# EasyEDA Pro project ProPrj_USB Connector_2025-09-04.epro

# Schematic Schematic1
Board Name: Board1; Create Date: 2025-08-17; Page Name: P1; Project Name: USB Connector; Schematic Name: Schematic1; Update Date: 2025-08-22; Company: EasyEDA.com; Page Size: A4; Version: V1.0
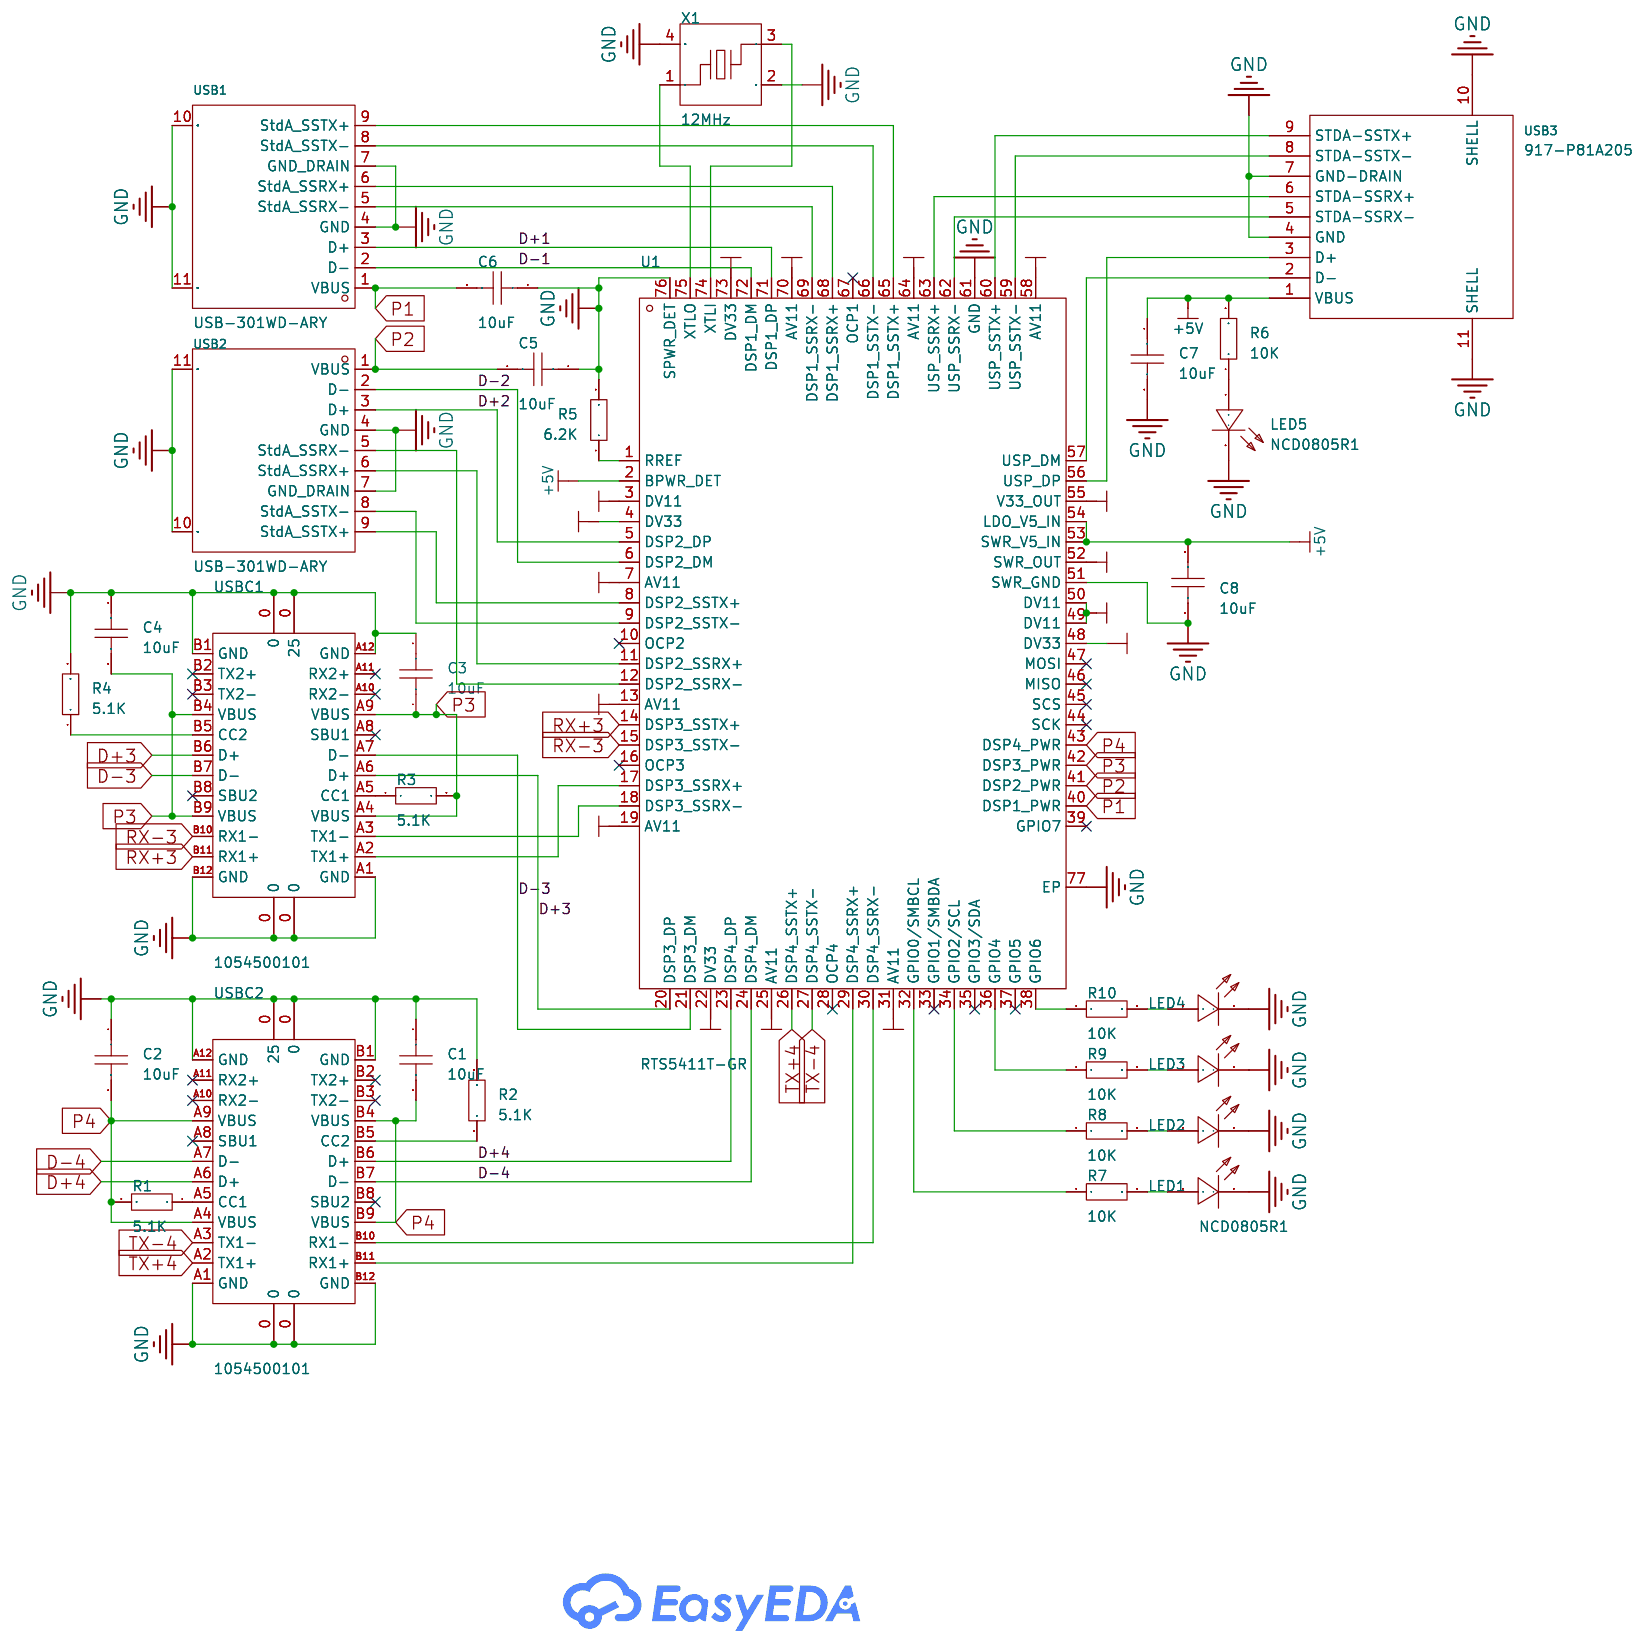
[diagram p0: schematic sheet]

## Parts
C1  10uF  [C0603]
C2  10uF  [C0603]
C3  10uF  [C0603]
C4  10uF  [C0603]
C5  10uF  [C0603]
C6  10uF  [C0603]
C7  10uF  [C0603]
C8  10uF  [C0603]
LED1  NCD0805R1  [LED0805-R-RD]
LED2  NCD0805R1  [LED0805-R-RD]
LED3  NCD0805R1  [LED0805-R-RD]
LED4  NCD0805R1  [LED0805-R-RD]
LED5  NCD0805R1  [LED0805-R-RD]
R1  5.1K  [R0603]
R2  5.1K  [R0603]
R3  5.1K  [R0603]
R4  5.1K  [R0603]
R5  6.2K  [R0603]
R6  10K  [R0603]
R7  10K  [R0603]
R8  10K  [R0603]
R9  10K  [R0603]
R10  10K  [R0603]
U1  RTS5411T-GR  [QFN-76_L9.0-W9.0-P0.40-BL-EP5.4]
USB1  USB-301WD-ARY  [USB-TH_XUNPU_USB-301WD-ARY]
USB2  USB-301WD-ARY  [USB-TH_XUNPU_USB-301WD-ARY]
USB3  917-P81A205CS60202  [USB-3.0-SMD_CU3M002_USBA-M]
USBC1  1054500101  [USB-C-SMD_TYPE-C-USB-18]
USBC2  1054500101  [USB-C-SMD_TYPE-C-USB-18]
X1  12MHz  [CRYSTAL-SMD_4P-L3.2-W2.5-BL-1]

## Library data of the parts
C1-C8 = CAP_0603: Supplier Footprint: 0603
LED1-LED5 = NCD0805R1_C84256: Lamp Holder Type:- Emitted Color:Red Forward Voltage (VF):1.6V~2.6V Forward Voltage (VF):1.6V~2.6V Power Dissipation:65mW Forward Current:20mA Dominant Wavelength:615nm~630nm Dominant Wavelength:615nm~630nm Peak Wavelength:- Diode Configuration:独立二极管 Lens; Supplier Part: C84256; Manufacturer: 国星光电; Supplier Footprint: 0805; JLCPCB Part Class: Basic Part; Datasheet: https://atta.szlcsc.com/upload/public/pdf/source/20200820/C84256_F0A75A43B3EAD75808600A0514C76B99.pdf; Supplier: LCSC; Emitted Color: Red; Forward Voltage (VF): 1.6V~2.6V; Power Dissipation: 65mW; Forward Current: 20mA; Dominant Wavelength: 615nm~630nm; Diode Configuration: 独立二极管; Lens Color: 无色透明透镜; Luminous Intensity: 67mcd~195mcd; Viewing Angle: 130°; Operating Temperature: -30℃~+85℃
R1-R10 = Res_0603: Supplier Footprint: 0603
U1 = RTS5411T-GR: type:Hub USB Protocol:USB 3.2 Voltage - Supply:3.3V；1.1V Voltage - Supply:3.3V；1.1V Operating Temperature:0℃~+70℃ Operating Temperature:0℃~+70℃; LCSC Part Name: RTS5411T USB3.2 Gen1x1 超高速 USB 集线器控制器; Supplier Part: C5159024; Manufacturer: REALTEK(瑞昱); Supplier Footprint: QFN-76(9x9); JLCPCB Part Class: Extended Part; Datasheet: https://atta.szlcsc.com/upload/public/pdf/source/20240319/5D12B3C0D31F8AE4B5F4A601072DAD0E.pdf; Supplier: LCSC; type: Hub; USB Protocol: USB 3.2; Voltage - Supply: 3.3V；1.1V; Operating Temperature: 0℃~+70℃
USB1 USB2 = USB-301WD-ARY: Connector Type:Type-A Standard:USB 3.0 Gender:Female Number of Ports:1 Number of Contacts:9P Mounting Style:Right-Angle Current Rating - Power (Max):1.8A Contact Material:- Contact Plating:- Operating Temperature Range:-55℃~+85℃ Operating Temperature Rang; LCSC Part Name: Type-A 母 弯插; Supplier Part: C2895025; Manufacturer: XUNPU(讯普); Supplier Footprint: 插件; JLCPCB Part Class: Extended Part; Datasheet: https://atta.szlcsc.com/upload/public/pdf/source/20210908/6BA804621BB79CD49F2A1A281A5A9824.pdf; Supplier: LCSC; Connector Type: Type-A; Standard: USB 3.0; Gender: Female; Number of Ports: 1; Number of Contacts: 9P; Mounting Style: Right-Angle; Current Rating - Power (Max): 1.8A; Operating Temperature Range: -55℃~+85℃; Soldering Temperature(Max): 260℃
USB3 = 917-P81A205CS60202: Connector Type:Type-A Protocol Standard:USB 3.0 Gender:Male Number of Contacts:9P Number of Ports:1 Current Rating-Power:250mA; LCSC Part Name: Type-A 公; Supplier Part: C68740; Manufacturer: 精拓金; Supplier Footprint: SMD; JLCPCB Part Class: Extended Part; Datasheet: https://item.szlcsc.com/datasheet/917-P81A205CS60202/69850.html; Supplier: LCSC; Connector Type: Type-A; Protocol Standard: USB 3.0; Gender: Male; Number of Contacts: 9P; Number of Ports: 1; Current Rating-Power: 250mA
USBC1 USBC2 = 1054500101: Connector Type:Type-C Protocol Standard:USB 3.2 Gender:Female Number of Contacts:24P Number of Ports:1 Current Rating-Power:- Operating Temperature:-30℃~+85℃ Operating Temperature:-30℃~+85℃; LCSC Part Name: Type-C 母; Supplier Part: C134092; Manufacturer: MOLEX; Supplier Footprint: SMD; JLCPCB Part Class: Extended Part; Datasheet: https://www.molex.com/content/dam/molex/molex-dot-com/products/automated/en-us/salesdrawingpdf/105/105450/1054500101_sd.pdf?inline\; Supplier: LCSC; Connector Type: Type-C; Protocol Standard: USB 3.2; Gender: Female; Number of Contacts: 24P; Number of Ports: 1; Operating Temperature: -30℃~+85℃
X1 = XL2EL89COI-111YLC-12M: Type:Crystal Oscillator Frequency:12MHz Normal temperature Frequency Tolerance:±10ppm Normal temperature Frequency Tolerance:±10ppm Load Capacitance:12pF Frequency Stability:±20ppm Frequency Stability:±20ppm Operating Temperature:-40℃~+85℃ Operating Tempe; LCSC Part Name: YSX321SL 12MHZ 4P 3225 12PF ±10PPM -40~85℃ (±20PPM); Supplier Part: C5280578; Manufacturer: YXC(扬兴晶振); Supplier Footprint: SMD3225-4P; JLCPCB Part Class: Extended Part; Datasheet: https://item.szlcsc.com/datasheet/XL2EL89COI-111YLC-12M/6016760.html; Supplier: LCSC; Type: Crystal Oscillator; Normal temperature Frequency Tolerance: ±10ppm; Load Capacitance: 12pF; Frequency Stability: ±20ppm; Operating Temperature: -40℃~+85℃

## Nets
+1V1: U1.3(DV11) U1.7(AV11) U1.13(AV11) U1.19(AV11) U1.25(AV11) U1.31(AV11) U1.49(DV11) U1.50(DV11) U1.52(SWR_OUT) U1.58(AV11) U1.64(AV11) U1.70(AV11)
+3V3: U1.4(DV33) U1.22(DV33) U1.48(DV33) U1.55(V33_OUT) U1.73(DV33)
+5V: C7.1 C8.2 R6.2 U1.2(BPWR_DET) U1.53(SWR_V5_IN) U1.54(LDO_V5_IN) USB3.1(VBUS)
GND: C1.1 C2.1 C3.2 C4.1 C5.1 C6.1 C7.2 C8.1 LED1.2(-) LED2.2(-) LED3.2(-) LED4.2(-) LED5.2(-) R2.2 R4.2 R5.2 U1.51(SWR_GND) U1.61(GND) U1.76(SPWR_DET) U1.77(EP) USB1.4(GND) USB1.7(GND_DRAIN) USB1.10(SHIELD) USB1.11(SHIELD) USB2.4(GND) USB2.7(GND_DRAIN) USB2.10(SHIELD) USB2.11(SHIELD) USB3.4(GND) USB3.7(GND-DRAIN) USB3.10(SHELL) USB3.11(SHELL) USBC1.0 USBC1.A1(GND) USBC1.A12(GND) USBC1.B1(GND) USBC1.B12(GND) USBC2.0 USBC2.A1(GND) USBC2.A12(GND) USBC2.B1(GND) USBC2.B12(GND) X1.2(GND) X1.4(GND)
D+1: U1.71(DSP1_DP) USB1.3(D+)
D+2: U1.5(DSP2_DP) USB2.3(D+)
D+3: U1.20(DSP3_DP) USBC1.A6(D+) USBC1.B6(D+)
D+4: U1.23(DSP4_DP) USBC2.A6(D+) USBC2.B6(D+)
D-1: U1.72(DSP1_DM) USB1.2(D-)
D-2: U1.6(DSP2_DM) USB2.2(D-)
D-3: U1.21(DSP3_DM) USBC1.A7(D-) USBC1.B7(D-)
D-4: U1.24(DSP4_DM) USBC2.A7(D-) USBC2.B7(D-)
P1: C6.2 U1.40(DSP1_PWR) USB1.1(VBUS)
P2: C5.2 U1.41(DSP2_PWR) USB2.1(VBUS)
P3: C3.1 C4.2 R3.2 U1.42(DSP3_PWR) USBC1.A4(VBUS) USBC1.A9(VBUS) USBC1.B4(VBUS) USBC1.B9(VBUS)
P4: C1.2 C2.2 R1.2 U1.43(DSP4_PWR) USBC2.A4(VBUS) USBC2.A9(VBUS) USBC2.B4(VBUS) USBC2.B9(VBUS)
RX+3: U1.14(DSP3_SSTX+) USBC1.B11(RX1+)
RX-3: U1.15(DSP3_SSTX-) USBC1.B10(RX1-)
TX+4: U1.26(DSP4_SSTX+) USBC2.A2(TX1+)
TX-4: U1.27(DSP4_SSTX-) USBC2.A3(TX1-)
$1N3590: U1.12(DSP2_SSRX-) USB2.5(StdA_SSRX-)
$1N3596: U1.11(DSP2_SSRX+) USB2.6(StdA_SSRX+)
$1N3603: U1.8(DSP2_SSTX+) USB2.9(StdA_SSTX+)
$1N3610: U1.9(DSP2_SSTX-) USB2.8(StdA_SSTX-)
$1N3617: U1.65(DSP1_SSTX+) USB1.9(StdA_SSTX+)
$1N3622: U1.66(DSP1_SSTX-) USB1.8(StdA_SSTX-)
$1N3628: U1.69(DSP1_SSRX-) USB1.5(StdA_SSRX-)
$1N3637: U1.68(DSP1_SSRX+) USB1.6(StdA_SSRX+)
$1N3848: U1.29(DSP4_SSRX+) USBC2.B11(RX1+)
$1N3853: U1.30(DSP4_SSRX-) USBC2.B10(RX1-)
$1N3939: R1.1 USBC2.A5(CC1)
$1N3974: R2.1 USBC2.B5(CC2)
$1N3996: U1.18(DSP3_SSRX-) USBC1.A3(TX1-)
$1N4002: U1.17(DSP3_SSRX+) USBC1.A2(TX1+)
$1N4082: R3.1 USBC1.A5(CC1)
$1N4114: R4.1 USBC1.B5(CC2)
$1N4604: U1.59(USP_SSTX-) USB3.8(STDA-SSTX-)
$1N4609: U1.60(USP_SSTX+) USB3.9(STDA-SSTX+)
$1N4615: U1.62(USP_SSRX-) USB3.5(STDA-SSRX-)
$1N4620: U1.63(USP_SSRX+) USB3.6(STDA-SSRX+)
$1N4626: U1.57(USP_DM) USB3.2(D-)
$1N4632: U1.56(USP_DP) USB3.3(D+)
$1N5187: R5.1 U1.1(RREF)
$1N5405: U1.75(XTLO) X1.1
$1N5413: U1.74(XTLI) X1.3
$1N5825: R10.1 U1.38(GPIO6)
$1N5829: R9.1 U1.36(GPIO4)
$1N5835: R8.1 U1.34(GPIO2/SCL)
$1N5841: R7.1 U1.32(GPIO0/SMBCL)
$1N5974: LED5.1(+) R6.1
$1N6057: LED1.1(+) R7.2
$1N6084: LED2.1(+) R8.2
$1N6111: LED3.1(+) R9.2
$1N6138: LED4.1(+) R10.2

Not connected (* = marked no-connect by the designer): U1 10(OCP2)* 16(OCP3)* 28(OCP4)* 33(GPIO1/SMBDA)* 35(GPIO3/SDA)* 37(GPIO5)* 39(GPIO7)* 44(SCK)* 45(SCS)* 46(MISO)* 47(MOSI)* 67(OCP1)*; USBC1 A8(SBU1)* A10(RX2-)* A11(RX2+)* B2(TX2+)* B3(TX2-)* B8(SBU2)*; USBC2 A8(SBU1)* A10(RX2-)* A11(RX2+)* B2(TX2+)* B3(TX2-)* B8(SBU2)*

# Board PCB1
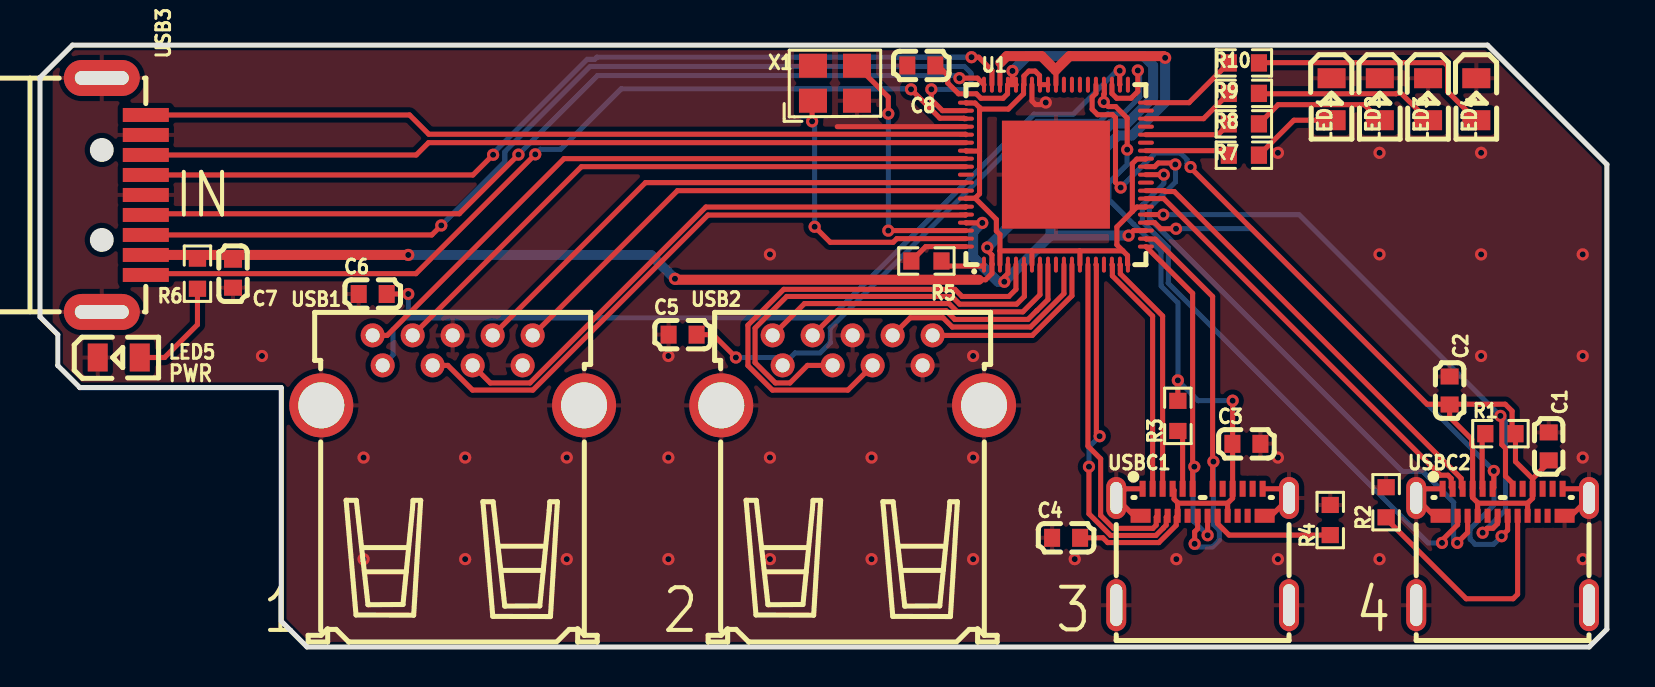
[diagram p1: board, top side]
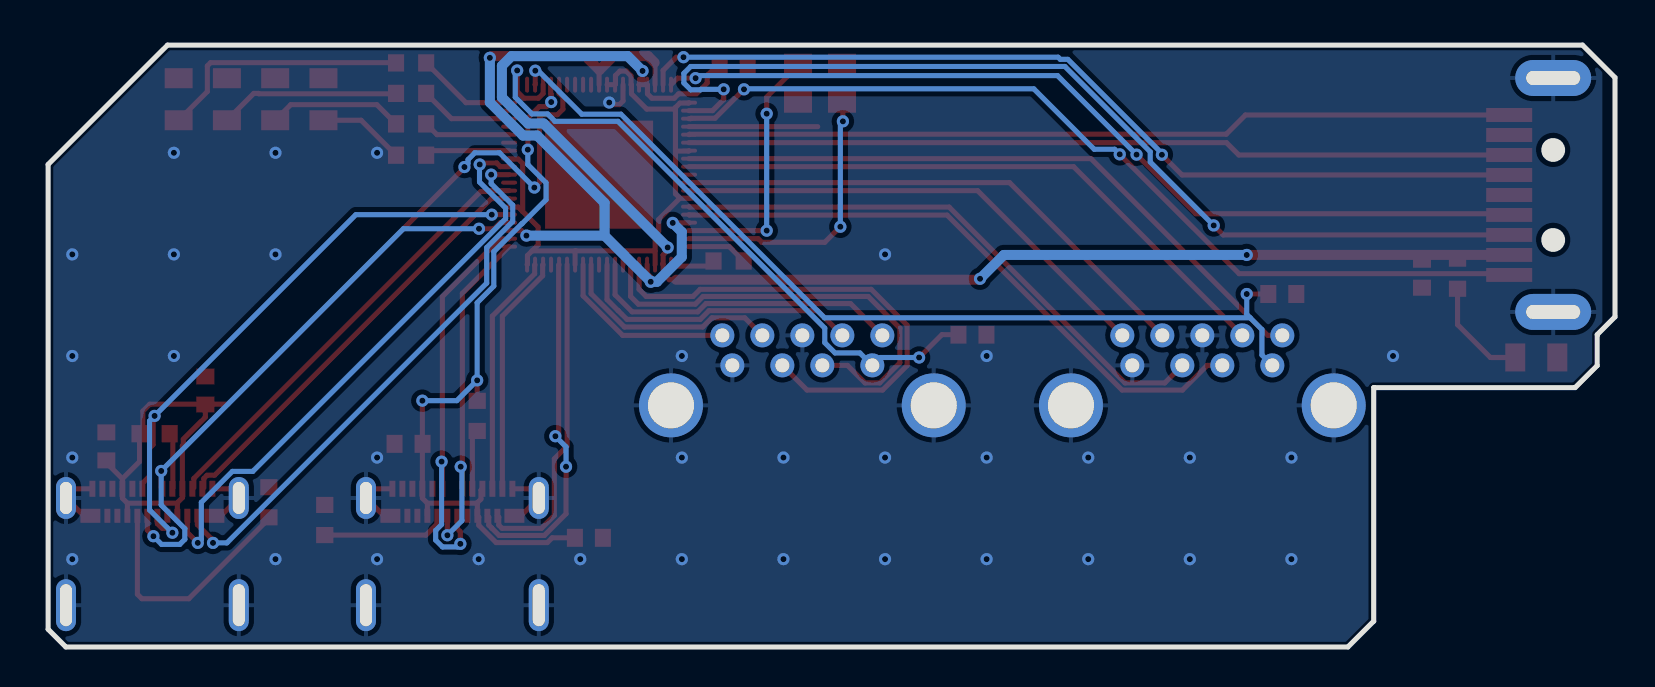
[diagram p2: board, bottom side, seen from below]

Outline 78.35 x 30.1 mm; copper layers: Top Layer, Bottom Layer. Coordinates in mm from the lower left corner of the outline.
Outline path: 0,28.48 1.62,30.1 72.38,30.1 78.35,24.13 78.35,0.89 77.46,0 13.36,0 12.07,1.29 12.07,12.97 1.99,12.97 0.89,14.08 0.89,15.62 0,16.51 0,28.48
Stack: Top Layer 0.035mm / Dielectric1 1.51mm FR4 er 4.5 / Bottom Layer 0.035mm

## Design rules (mm)
template: JLCPCB Capability(Two Layers Board)
spacing copperThickness1oz (default): track to track 0.102, other pairs 0.152 to 0.3
spacing copperThickness2oz: track to track 0.203, other pairs 0.152 to 0.3
track width copperThickness1oz (default): min 0.127, default 0.254, max 2.54
track width copperThickness2oz: min 0.203, default 0.254, max 2.54
differential pair differentialPair (default): width min 0.127, default 0.254, max 2.54; gap min 0.152, default 0.152
via viaSize (default): diameter min 0.5, default 0.61, max 10; hole min 0.3, default 0.305, max 6.3

## Placement (name value [footprint] x y rotation side)
C1  10uF  [C0603]  75.44 10.03 270 top
C2  10uF  [C0603]  70.48 12.83 270 top
C3  10uF  [C0603]  60.33 10.16 0 top
C4  10uF  [C0603]  51.31 5.46 0 top
C5  10uF  [C0603]  32.13 15.62 0 top
C6  10uF  [C0603]  16.64 17.65 0 top
C7  10uF  [C0603]  9.65 18.67 270 top
C8  10uF  [C0603]  44.07 29.08 0 top
LED1  NCD0805R1  [LED0805-R-RD]  64.58 27.39 270 top
LED2  NCD0805R1  [LED0805-R-RD]  67 27.39 270 top
LED3  NCD0805R1  [LED0805-R-RD]  69.41 27.39 270 top
LED4  NCD0805R1  [LED0805-R-RD]  71.82 27.39 270 top
LED5  NCD0805R1  [LED0805-R-RD]  3.94 14.48 0 top
R1  5.1K  [R0603]  73.02 10.67 0 top
R2  5.1K  [R0603]  67.31 7.24 90 top
R3  5.1K  [R0603]  56.9 11.56 90 top
R4  5.1K  [R0603]  64.52 6.35 90 top
R5  6.2K  [R0603]  44.32 19.3 180 top
R6  10K  [R0603]  7.87 18.67 90 top
R7  10K  [R0603]  60.2 24.6 0 top
R8  10K  [R0603]  60.2 26.16 0 top
R9  10K  [R0603]  60.2 27.69 0 top
R10  10K  [R0603]  60.2 29.21 0 top
U1  RTS5411T-GR  [QFN-76_L9.0-W9.0-P0.40-BL-EP5.4]  50.8 23.62 0 top
USB1  USB-301WD-ARY  [USB-TH_XUNPU_USB-301WD-ARY]  20.64 13.83 0 top
USB2  USB-301WD-ARY  [USB-TH_XUNPU_USB-301WD-ARY]  40.64 13.83 0 top
USB3  917-P81A205CS60202  [USB-3.0-SMD_CU3M002_USBA-M]  4.19 22.61 270 top
USBC1  1054500101  [USB-C-SMD_TYPE-C-USB-18]  58.14 5 0 top
USBC2  1054500101  [USB-C-SMD_TYPE-C-USB-18]  73.14 5 0 top
X1  12MHz  [CRYSTAL-SMD_4P-L3.2-W2.5-BL-1]  39.75 28.19 0 top

## Footprints (pads in the part's own frame, mm; a bottom-side part is the same pattern mirrored in y, then rotated)
C0603
  rect 0.8x0.9 smd: 1(-0.7,0) 2(0.7,0)
CRYSTAL-SMD_4P-L3.2-W2.5-BL-1
  rect 1.4x1.2 smd: 1(-1.1,-0.875) 2(1.1,-0.875) 3(1.1,0.875) 4(-1.1,0.875)
LED0805-R-RD
  rect 1x1.399 smd: 1(1.05,0) 2(-1.05,0)
QFN-76_L9.0-W9.0-P0.40-BL-EP5.4
  oval 0.2x0.8 smd: 1(-3.599,-4.5) 2(-3.2,-4.5) 3(-2.799,-4.5) 4(-2.401,-4.5) 5(-1.999,-4.5) 6(-1.6,-4.5) 7(-1.199,-4.5) 8(-0.8,-4.5) 9(-0.399,-4.5) 10(0,-4.5) 11(0.399,-4.5) 12(0.8,-4.5) 13(1.199,-4.5) 14(1.6,-4.5) 15(1.999,-4.5) 16(2.401,-4.5) 17(2.799,-4.5) 18(3.2,-4.5) 19(3.599,-4.5) 39(3.599,4.5) 40(3.2,4.5) 41(2.799,4.5) 42(2.401,4.5) 43(1.999,4.5) 44(1.6,4.5) 45(1.199,4.5) 46(0.8,4.5) 47(0.399,4.5) 48(0,4.5) 49(-0.399,4.5) 50(-0.8,4.5) 51(-1.199,4.5) 52(-1.6,4.5) 53(-1.999,4.5) 54(-2.401,4.5) 55(-2.799,4.5) 56(-3.2,4.5) 57(-3.599,4.5)
  oval 0.8x0.2 smd: 20(4.5,-3.599) 21(4.5,-3.2) 22(4.5,-2.799) 23(4.5,-2.401) 24(4.5,-1.999) 25(4.5,-1.6) 26(4.5,-1.199) 27(4.5,-0.8) 28(4.5,-0.399) 29(4.5,0) 30(4.5,0.399) 31(4.5,0.8) 32(4.5,1.199) 33(4.5,1.6) 34(4.5,1.999) 35(4.5,2.401) 36(4.5,2.799) 37(4.5,3.2) 38(4.5,3.599) 58(-4.5,3.599) 59(-4.5,3.2) 60(-4.5,2.799) 61(-4.5,2.401) 62(-4.5,1.999) 63(-4.5,1.6) 64(-4.5,1.199) 65(-4.5,0.8) 66(-4.5,0.399) 67(-4.5,0) 68(-4.5,-0.399) 69(-4.5,-0.8) 70(-4.5,-1.199) 71(-4.5,-1.6) 72(-4.5,-1.999) 73(-4.5,-2.401) 74(-4.5,-2.799) 75(-4.5,-3.2) 76(-4.5,-3.599)
  rect 5.4x5.4 smd: 77(0,0)
R0603
  rect 0.806x0.864 smd: 1(-0.753,0) 2(0.753,0)
USB-3.0-SMD_CU3M002_USBA-M
  rect 0.7x2.3 smd: 1(3,1.1) 2(1,1.1) 3(-1,1.1) 4(-3,1.1) 5(-4,1.1) 6(-2,1.1) 7(0,1.1) 8(2,1.1) 9(4,1.1)
  oval 1.8x3.8 hole 0.7x2.7: 10(5.85,-1.1) 11(-5.85,-1.1)
USB-C-SMD_TYPE-C-USB-18
  oval 1x2.1 hole 0.6x1.6: 0(-4.32,2.45) 0(4.32,2.45)
  oval 1x2.6 hole 0.6x2.1: 0(-4.32,-2.91) 0(4.32,-2.91)
  rect 0.3x0.8 smd: A1(-3,2.91) A2(-2.5,2.91) A3(-2,2.91) A4(-1.5,2.91) A5(-1,2.91) A6(-0.5,2.91) A7(0.5,2.91) A8(1,2.91) A9(1.5,2.91) A10(2,2.91) A11(2.5,2.91) A12(3,2.91)
  rect 1x0.7 smd: B1(3.1,1.56) B12(-3.1,1.56)
  rect 0.3x0.7 smd: B2(2.25,1.56) B3(1.75,1.56) B4(1.25,1.56) B5(0.75,1.56) B6(0.25,1.56) B7(-0.25,1.56) B8(-0.75,1.56) B9(-1.25,1.56) B10(-1.75,1.56) B11(-2.25,1.56)
USB-TH_XUNPU_USB-301WD-ARY
  round 1.2 hole 0.7: 1(-3.5,0.25) 2(-1,0.25) 3(1,0.25) 4(3.5,0.25) 5(4,1.75) 6(2,1.75) 7(0,1.75) 8(-2,1.75) 9(-4,1.75)
  round 3.2 hole 2.3: 10(-6.57,-1.75) 11(6.57,-1.75)

## Nets
As in the schematic.

Pads without a net: U1 10 16 28 33 35 37 39 44 45 46 47 67; USBC1 A8 A10 A11 B2 B3 B8; USBC2 A8 A10 A11 B2 B3 B8

## Via types
v1: diameter 0.61, hole 0.305, Top Layer to Bottom Layer, 80 vias

## Routing (per net, layer and track width the routed paths; a pad name or vN(x,y) marks a point on that pad's centre or on a via; arc(x,y) is an arc through that point)
+1V1: length 30.4
  Top Layer w0.254: 51.98,19.81 52,19.79 U1.13 ; 51.98,19.81 54.15,19.81 ; 51.98,19.81 49.58,19.81 ; 46.76,22.44 46.32,22.44 U1.70 ; 46.76,22.44 46.98,22.66 46.98,24.8 ; 46.76,22.44 47.82,21.38 47.82,20.81 48,20.63 48,19.81 ; 48,19.81 49.58,19.81 ; 48,19.81 U1.3 ; 49.58,19.81 49.6,19.79 U1.7 ; 46.98,26.98 46.76,27.2 46.32,27.2 U1.58 ; 46.98,26.98 47.06,26.9 48.42,26.9 49.18,27.66 49.18,28.1 U1.52 49.2,28.56 49.44,28.8 49.76,28.8 49.98,28.58 49.98,28.14 U1.50 U1.49 ; 46.98,26.98 46.98,24.8 ; U1.25 55.28,22 54.84,22 54.62,21.78 ; 46.98,24.8 46.32,24.8 U1.64 ; U1.31 55.28,24.4 54.84,24.4 54.62,24.18 54.62,21.79 54.62,21.78 ; 54.62,21.78 53.85,21.01 53.85,20.11 54.15,19.81 ; 54.15,19.81 54.38,19.58 54.38,19.14 U1.19
+3V3: length 36.3
  Top Layer w0.254: U1.73 46.31,21.21 v1(47.12,21.21) ; v1(54.43,20.57) 54.68,20.82 U1.22 ; v1(48.22,18.27) 48.22,18.5 48.4,18.68 U1.4 ; U1.55 48,29.2 ; U1.48 50.8,28.83
  Top Layer w0.5: 48.02,29.22 48.35,29.55 50.08,29.55 50.78,28.85 51.48,29.55 56.18,29.55 v1(56.26,29.46)
  Bottom Layer w0.5: v1(54.43,20.57) 50.53,20.57 ; 50.53,20.57 v1(48.22,18.27) 47.9,18.27 46.66,19.5 46.66,20.76 v1(47.12,21.21) ; 50.53,20.57 50.53,22.21 53.9,25.58 54.6,25.58 56.26,27.24 v1(56.26,29.46)
+5V: length 71.1
  Top Layer w0.254: C8.2 44.9,29.08 45.39,28.59 45.39,28.21 45.93,27.66 46.82,27.66 47.04,27.44 48.16,27.44 48.38,27.66 48.38,28.1 U1.54 U1.53 48.63,28.3 v1(48.63,28.81) ; U1.2 47.6,18.69 47.28,18.37 46.95,18.37 ; v1(47.37,19.98) 47.37,19.83 47.6,19.6 47.6,19.17 47.62,19.14
  Top Layer w0.5: v1(31.75,18.41) 31.8,18.37 46.95,18.37 ; USB3.1 v1(18.42,19.61)
  Bottom Layer w0.5: v1(47.37,19.98) 53.57,26.18 54.35,26.18 55.66,27.49 55.66,29.07 55.18,29.55 49.37,29.55 v1(48.63,28.81) ; v1(18.42,19.61) 30.56,19.61 v1(31.75,18.41)
GND: length 23.4
  Top Layer w0.254: USBC2.B12 69.7,6.56 USBC2.0 69.27,7.91 USBC2.A1 ; USBC2.A12 77,7.91 USBC2.0 76.57,6.56 USBC2.B1 ; USBC1.A12 62,7.91 USBC1.0 61.57,6.56 USBC1.B1 ; U1.51 49.6,27.3 49.78,27.13 50.29,27.13 ; U1.76 44.29,20.02 R5.2 ; U1.61 39.87,26.02 ; USBC1.B12 54.7,6.56 USBC1.0 54.27,7.91 USBC1.A1
  vias: v1(11.1,14.55) v1(16.18,9.47) v1(16.18,4.39) v1(21.26,9.47) v1(21.26,4.39) v1(26.34,9.47) v1(26.34,4.39) v1(31.42,14.55) v1(31.42,9.47) v1(31.42,4.39) v1(36.5,19.63) v1(36.5,9.47) v1(36.5,4.39) v1(41.58,9.47) v1(41.58,4.39) v1(46.66,14.55) v1(46.66,9.47) v1(46.66,4.39) v1(50.29,27.23) v1(51.74,4.39) v1(56.82,4.39) v1(61.9,24.71) v1(61.9,9.47) v1(61.9,4.39) v1(66.98,24.71) v1(66.98,19.63) v1(66.98,4.39) v1(72.06,24.71) v1(72.06,19.63) v1(72.06,14.55) v1(77.14,19.63) v1(77.14,14.55) v1(77.14,9.47) v1(77.14,4.39)
D+1: length 28.7
  Top Layer w0.254: U1.71 46.28,22 33.3,22 24.5,13.2 22.51,13.2 USB1.3
D+2: length 25
  Top Layer w0.254: U1.5 48.8,17.89 48.44,17.53 46.11,17.53 45.75,17.89 37.19,17.89 35.4,16.1 35.4,14.07 36.62,12.85 40.4,12.85 USB2.3
D+3: length 17.8
  Top Layer w0.254: USBC1.A6 57.64,17.69 U1.20 ; USBC1.B6 v1(58.39,5.59)
  Bottom Layer w0.254: v1(58.39,5.59) 57.66,6.31 57.66,9.02
  vias: v1(57.72,9.02)
D+4: length 30.4
  Top Layer w0.254: U1.23 55.74,21.22 56.04,20.92 v1(56.8,20.92) ; v1(72.7,8.8) 72.7,7.97 USBC2.A6 ; USBC2.B6 73.39,5.84 v1(73.08,5.54)
  Bottom Layer w0.254: v1(56.8,20.92) 60.58,20.92 v1(72.7,8.8) 72.7,7.1 71.51,5.92 71.51,5.38 71.77,5.13 72.67,5.13 v1(73.08,5.54)
D-1: length 30.8
  Top Layer w0.254: U1.72 46.28,21.6 33.4,21.6 24.65,12.85 21.63,12.85 20.39,14.08 USB1.2
D-2: length 22.4
  Top Layer w0.254: U1.6 49.22,19.1 49.22,17.53 48.84,17.14 45.99,17.14 45.6,17.53 37.34,17.53 35.76,15.95 35.76,14.22 36.77,13.2 37.5,13.2 38.38,14.08 USB2.2
D-3: length 21.1
  Top Layer w0.254: U1.21 55.32,20.4 55.76,20.4 58.64,17.52 USBC1.A7 ; USBC1.B7 57.89,5.91 57.74,5.77 v1(57.74,5.16)
  Bottom Layer w0.254: v1(58.67,9.27) 58.67,6.12 58.97,5.83 58.97,5.35 58.63,5 57.89,5 v1(57.74,5.16)
D-4: length 33.5
  Top Layer w0.254: USBC2.B7 72.89,6.17 72.65,5.93 72.35,5.93 v1(72.14,5.71) ; 56.16,21.62 U1.24 ; USBC2.A7 73.64,8.18 73.28,8.54 73.28,9.94 73.1,10.12 73.1,11.49 v1(73.02,11.56)
  Bottom Layer w0.254: v1(56.17,21.62) 62.96,21.62 v1(73.02,11.56) 73.28,11.3 73.28,6.86 v1(72.14,5.71)
P1: length 46.7
  Top Layer w0.254: U1.40 53.99,28.13 v1(53.99,28.82) ; C6.2 v1(18.42,17.65)
  Bottom Layer w0.254: USB1.1 17.65,14.6 17.65,15.88 18.24,16.46 ; v1(18.42,17.65) 18.42,16.64 18.24,16.46 ; 18.24,16.46 39.53,16.46 49.71,26.64 51.66,26.64 53.84,28.82 v1(53.99,28.82)
P2: length 33.2
  Top Layer w0.254: v1(54.89,28.83) 54.89,27.78 54.56,27.44 53.84,27.44 53.6,27.68 U1.41 ; C5.2 33.66,15.62 v1(34.8,14.48)
  Bottom Layer w0.254: v1(34.8,14.48) 36.74,14.48 USB2.1 37.76,14.7 39,14.7 39.51,15.22 39.51,15.95 49.86,26.29 53,26.29 53.37,26.66 54.16,26.66 54.99,27.49 54.99,28.73 v1(54.89,28.83)
P3: length 37.1
  Top Layer w0.254: v1(56.9,13.33) R3.2 ; 56.89,7.19 59.39,7.19 ; 56.89,7.19 USBC1.B9 56.81,6.49 56.81,6.09 55.95,5.22 53.39,5.22 53.15,5.46 C4.2 ; 56.89,7.19 56.89,7.22 56.71,7.4 56.71,7.84 USBC1.A4 ; 59.39,7.19 USBC1.B4 ; 59.39,7.19 59.64,7.44 USBC1.A9 v1(59.64,12.32) ; U1.42 53.22,28.1 53.22,27.66 53.19,27.64 v1(53.19,27.25) 53.42,27.03 53.79,27.03 54.36,26.45 v1(54.36,24.87)
  Bottom Layer w0.254: v1(54.36,24.87) 54.36,24.13 53.45,23.22 53.45,22.37 54.66,21.16 54.67,21.16 56.06,19.77 56.06,18.05 56.9,17.22 v1(56.9,13.33) 57.91,12.32 v1(59.64,12.32)
P4: length 47.7
  Top Layer w0.254: 74.64,8.41 73.78,9.27 R1.2 73.61,10.84 73.61,11.8 73.27,12.14 69.36,12.14 57.53,23.97 v1(57.53,24) ; 74.64,8.41 75.44,9.22 C1.2 ; 74.64,8.41 USBC2.A9 74.64,7.44 74.39,7.19 ; 74.39,7.19 71.89,7.19 ; 74.39,7.19 USBC2.B4 ; 71.89,7.19 71.89,7.22 71.63,7.47 71.63,7.91 USBC2.A4 71.64,10.07 71.59,10.12 71.59,10.39 70.48,11.49 C2.2 ; 71.89,7.19 USBC2.B9 ; U1.43 52.8,27.68 52.61,27.49 52.61,26.89 52.88,26.62 53.63,26.62 53.78,26.47 53.78,23.23 v1(54.04,22.98)
  Bottom Layer w0.254: v1(54.04,22.98) 55.77,24.71 57.01,24.71 57.35,24.37 57.35,24.18 v1(57.53,24)
RX+3: length 16.4
  Top Layer w0.254: U1.14 52.4,10.05 53.04,9.41 53.04,6.58 53.68,5.93 55.65,5.93 55.81,6.1 55.81,6.49 USBC1.B11
RX-3: length 17.8
  Top Layer w0.254: v1(52.45,9.02) 52.45,6.66 53.54,5.58 55.8,5.58 56.17,5.95 56.17,5.95 56.31,6.1 56.31,6.49 USBC1.B10 ; v1(52.98,10.54) 52.82,10.7 52.82,19.1 U1.15
  Bottom Layer w0.254: v1(52.45,9.02) 52.45,10.01 v1(52.98,10.54)
TX+4: length 21.6
  Top Layer w0.254: USBC2.A2 70.56,7.98 70.56,8.43 70.4,8.59 70.02,8.59 56.19,22.42 U1.26
TX-4: length 22.3
  Top Layer w0.254: U1.27 56.23,22.82 56.27,22.78 56.72,22.78 71.06,8.43 71.06,7.98 USBC2.A3
$1N3590: length 9.3
  Top Layer w0.254: USB2.5 49.62,15.58 51.6,17.56 U1.12
$1N3596: length 11.3
  Top Layer w0.254: U1.11 51.2,17.67 49.53,16 45.62,16 45.16,16.46 43.51,16.46 USB2.6
$1N3603: length 16.1
  Top Layer w0.254: USB2.9 38.23,17.17 45.45,17.17 45.87,16.76 49.14,16.76 50,17.61 U1.8
$1N3610: length 14.6
  Top Layer w0.254: USB2.8 39.87,16.82 45.31,16.82 45.74,16.38 49.4,16.38 49.84,16.82 49.84,16.82 50.4,17.38 U1.9
$1N3617: length 33.3
  Top Layer w0.254: U1.65 26.2,24.42 17.36,15.58 USB1.9
$1N3622: length 31.2
  Top Layer w0.254: USB1.8 27.07,24.02 U1.66
$1N3628: length 24.7
  Top Layer w0.254: U1.69 31.87,22.82 USB1.5
$1N3637: length 26.8
  Top Layer w0.254: USB1.6 30.27,23.22 U1.68
$1N3848: length 28
  Top Layer w0.254: USBC2.B11 70.89,6.11 70.1,5.33 v1(70.1,5.21) ; v1(56.19,23.62) U1.29
  Bottom Layer w0.254: v1(56.19,23.62) 56.19,23.17 55.12,22.1 55.12,21.27 56.42,19.97 56.42,18.2 69.41,5.21 v1(70.1,5.21)
$1N3853: length 29.6
  Top Layer w0.254: v1(56.77,24.13) 56.69,24.21 55.92,24.21 55.73,24.02 U1.30 ; USBC2.B10 71.39,5.73 v1(70.87,5.21)
  Bottom Layer w0.254: v1(70.87,5.21) 70.69,5.38 70.69,7.23 69.14,8.78 68.11,8.78 55.47,21.42 55.47,21.95 56.78,23.25 56.78,24.02 56.77,24.03 v1(56.77,24.13)
$1N3939: length 2.8
  Top Layer w0.254: R1.1 72.11,10.51 72.11,7.94 USBC2.A5
$1N3974: length 12.3
  Top Layer w0.254: R2.1 67.31,6.42 71.31,2.41 73.66,2.41 73.89,2.64 USBC2.B5
$1N3996: length 12.1
  Top Layer w0.254: USBC1.A3 56.14,16.55 54.02,18.67 54.02,19.1 U1.18
$1N4002: length 12.1
  Top Layer w0.254: USBC1.A2 55.64,16.55 53.62,18.56 53.62,19.1 U1.17
$1N4082: length 3
  Top Layer w0.254: USBC1.A5 57.14,10.56 R3.1
$1N4114: length 6.3
  Top Layer w0.254: R4.1 59.46,5.6 58.89,6.17 USBC1.B5
$1N4604: length 50.7
  Top Layer w0.254: U1.59 45.12,26.82 44.57,27.38 v1(44.57,27.89) ; v1(20.07,21.08) 19.59,20.61 4.84,20.61
  Bottom Layer w0.254: v1(20.07,21.08) 23.24,24.26 23.24,24.77 27.51,29.03 46.22,29.03 46.56,28.69 46.56,28.21 46.22,27.86 45.73,27.86 45.71,27.89 v1(44.57,27.89)
$1N4609: length 45.9
  Top Layer w0.254: v1(24.77,24.64) 18.8,18.67 4.9,18.67 4.84,18.61 ; v1(43.55,27.89) 45,26.44 46.2,26.44 46.22,26.42 U1.60
  Bottom Layer w0.254: v1(24.77,24.64) 25.02,24.89 26.04,24.89 29.06,27.91 43.53,27.91 v1(43.55,27.89)
$1N4615: length 41.9
  Top Layer w0.254: 4.84,26.61 18.48,26.61 19.44,25.64 46.28,25.64 U1.62
$1N4620: length 41.7
  Top Layer w0.254: U1.63 19.43,25.22 18.81,24.61 4.84,24.61
$1N4626: length 45.4
  Top Layer w0.254: v1(45.97,28.45) 46.87,28.45 U1.57 ; 4.84,21.61 4.9,21.67 20.97,21.67 v1(23.92,24.62)
  Bottom Layer w0.254: v1(45.97,28.45) 45.85,28.57 27.88,28.57 v1(23.92,24.62)
$1N4632: length 46.2
  Top Layer w0.254: v1(46.58,29.49) 46.94,29.49 47.6,28.83 U1.56 ; 4.84,23.61 21.65,23.61 v1(22.66,24.62)
  Bottom Layer w0.254: v1(46.58,29.49) 27.84,29.49 27.74,29.39 27.36,29.39 22.66,24.68 v1(22.66,24.62)
$1N5187: length 1.9
  Top Layer w0.254: 45.33,19.05 47.13,19.05 U1.1
$1N5405: length 14.3
  Top Layer w0.254: X1.1 38.61,27.28 v1(38.61,26.29) ; U1.75 42.84,20.42 42.66,20.24 39.51,20.24 v1(38.73,21.02)
  Bottom Layer w0.254: v1(38.61,26.29) 38.73,26.16 v1(38.73,21.02)
$1N5413: length 12.8
  Top Layer w0.254: U1.74 v1(42.42,20.82) ; v1(42.42,26.67) 42.42,27.5 X1.3
  Bottom Layer w0.254: v1(42.42,20.82) v1(42.42,26.67)
$1N5825: length 5
  Top Layer w0.254: R10.1 57.46,27.22 U1.38
$1N5829: length 4.7
  Top Layer w0.254: R9.1 58.18,26.42 U1.36
$1N5835: length 4.4
  Top Layer w0.254: R8.1 58.9,25.62 U1.34
$1N5841: length 4.2
  Top Layer w0.254: U1.32 59.22,24.82 R7.1
$1N5974: length 5.4
  Top Layer w0.254: LED5.1 6.23,14.48 7.87,16.12 R6.1
$1N6057: length 4.4
  Top Layer w0.254: R7.2 62.7,26.34 LED1.1
$1N6084: length 6.8
  Top Layer w0.254: LED2.1 66.22,27.12 61.91,27.12 R8.2
$1N6111: length 9
  Top Layer w0.254: LED3.1 68.07,27.69 67.83,27.69 67.81,27.66 60.97,27.66 R9.2
$1N6138: length 12.8
  Top Layer w0.254: LED4.1 70.39,27.78 70.39,29.06 70.22,29.22 60.96,29.22 R10.2

## Copper pours and planes (outline as drawn; the poured copper is in the pictures)
GND on Top Layer: 0.64,30.1 78.98,30.1 78.98,0.13 0.64,0.13
GND on Bottom Layer: 0.64,30.1 78.98,30.1 78.98,0.13 0.64,0.13

## Text on the board
Top Silkscreen Layer: PWR | IN | 1 | 2 | 3 | 4
